# Altium schematic sheet UI.SchDoc
size A3; SheetNumber: 1; SheetTotal: 6
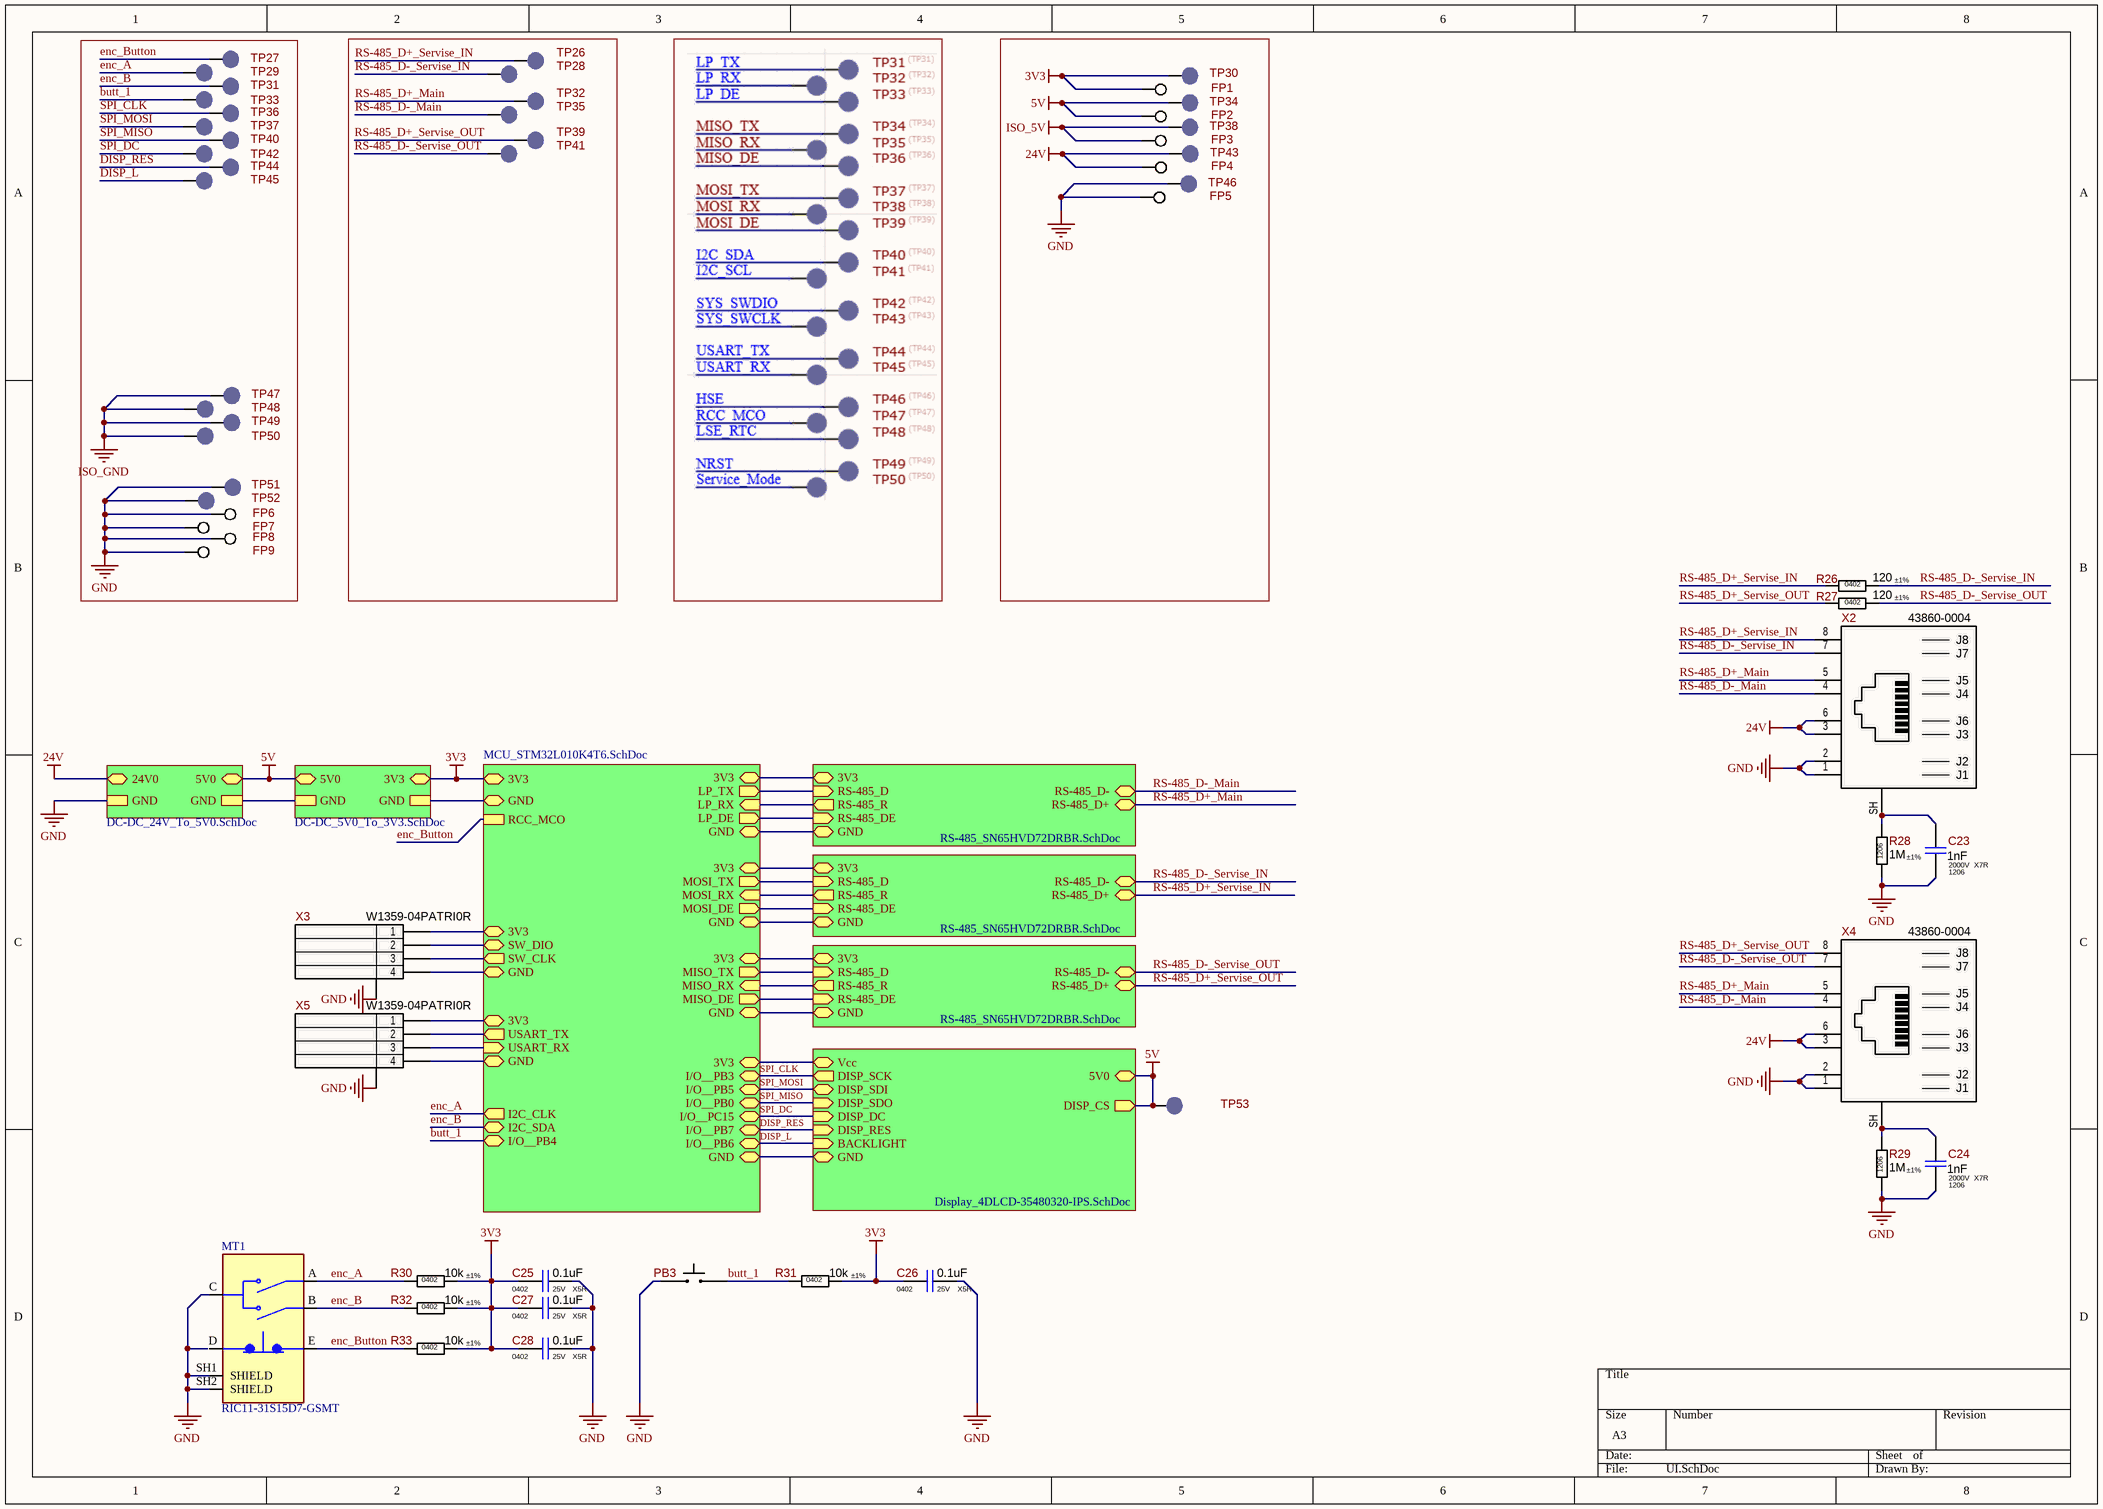
[diagram p0: UI.SchDoc]

## Parts
C23  Package: 1206  Voltage: 2000V  Dielectric Type: X7R  [CAP-1206(3216)X125T20]  (hidden comment: 1nF)
C24  Package: 1206  Voltage: 2000V  Dielectric Type: X7R  [CAP-1206(3216)X125T20]  (hidden comment: 1nF)
C25  Package: 0402  Voltage: 25V  Dielectric Type: X5R  [C_CERAMIC_0402_HI]  (hidden comment: 0.1uF)
C26  Package: 0402  Voltage: 25V  Dielectric Type: X5R  [C_CERAMIC_0402_HI]  (hidden comment: 0.1uF)
C27  Package: 0402  Voltage: 25V  Dielectric Type: X5R  [C_CERAMIC_0402_HI]  (hidden comment: 0.1uF)
C28  Package: 0402  Voltage: 25V  Dielectric Type: X5R  [C_CERAMIC_0402_HI]  (hidden comment: 0.1uF)
FP1  PAD-1.1mm  [PAD-1.1mm]  (value not drawn)  (no BOM)
FP2  PAD-1.1mm  [PAD-1.1mm]  (value not drawn)  (no BOM)
FP3  PAD-1.1mm  [PAD-1.1mm]  (value not drawn)  (no BOM)
FP4  PAD-1.1mm  [PAD-1.1mm]  (value not drawn)  (no BOM)
FP5  PAD-1.1mm  [PAD-1.1mm]  (value not drawn)  (no BOM)
FP6  PAD-1.1mm  [PAD-1.1mm]  (value not drawn)  (no BOM)
FP7  PAD-1.1mm  [PAD-1.1mm]  (value not drawn)  (no BOM)
FP8  PAD-1.1mm  [PAD-1.1mm]  (value not drawn)  (no BOM)
FP9  PAD-1.1mm  [PAD-1.1mm]  (value not drawn)  (no BOM)
MT1  RIC11-31S15D7-GSMT  [XDCR_RIC11-31S15D7-GSMT]
PB3  DS1042-24-2017VBR16005  [DS1042-24-2017VB]  (value not drawn)
R26  Tolerance: ±1%  Package: 0402  [R_ANY_CHIP_0402_HI]  (hidden comment: 120)
R27  Tolerance: ±1%  Package: 0402  [R_ANY_CHIP_0402_HI]  (hidden comment: 120)
R28  Tolerance: ±1%  Package: 1206  [CHV1206-Series]  (hidden comment: 1M)
R29  Tolerance: ±1%  Package: 1206  [CHV1206-Series]  (hidden comment: 1M)
R30  Tolerance: ±1%  Package: 0402  [R_ANY_CHIP_0402_MED]  (hidden comment: 10k)
R31  Tolerance: ±1%  Package: 0402  [R_ANY_CHIP_0402_MED]  (hidden comment: 10k)
R32  Tolerance: ±1%  Package: 0402  [R_ANY_CHIP_0402_MED]  (hidden comment: 10k)
R33  Tolerance: ±1%  Package: 0402  [R_ANY_CHIP_0402_MED]  (hidden comment: 10k)
TP26  LED_LINK  [TP_SMD_2mm]  (value not drawn)  (no BOM)
TP27  LED_LINK  [TP_SMD_2mm]  (value not drawn)  (no BOM)
TP28  LED_LINK  [TP_SMD_2mm]  (value not drawn)  (no BOM)
TP29  LED_LINK  [TP_SMD_2mm]  (value not drawn)  (no BOM)
TP30  LED_LINK  [TP_SMD_2mm]  (value not drawn)  (no BOM)
TP31  LED_LINK  [TP_SMD_2mm]  (value not drawn)  (no BOM)
TP32  LED_LINK  [TP_SMD_2mm]  (value not drawn)  (no BOM)
TP33  LED_LINK  [TP_SMD_2mm]  (value not drawn)  (no BOM)
TP34  LED_LINK  [TP_SMD_2mm]  (value not drawn)  (no BOM)
TP35  LED_LINK  [TP_SMD_2mm]  (value not drawn)  (no BOM)
TP36  LED_LINK  [TP_SMD_2mm]  (value not drawn)  (no BOM)
TP37  LED_LINK  [TP_SMD_2mm]  (value not drawn)  (no BOM)
TP38  LED_LINK  [TP_SMD_2mm]  (value not drawn)  (no BOM)
TP39  LED_LINK  [TP_SMD_2mm]  (value not drawn)  (no BOM)
TP40  LED_LINK  [TP_SMD_2mm]  (value not drawn)  (no BOM)
TP41  LED_LINK  [TP_SMD_2mm]  (value not drawn)  (no BOM)
TP42  LED_LINK  [TP_SMD_2mm]  (value not drawn)  (no BOM)
TP43  LED_LINK  [TP_SMD_2mm]  (value not drawn)  (no BOM)
TP44  LED_LINK  [TP_SMD_2mm]  (value not drawn)  (no BOM)
TP45  LED_LINK  [TP_SMD_2mm]  (value not drawn)  (no BOM)
TP46  LED_LINK  [TP_SMD_2mm]  (value not drawn)  (no BOM)
TP47  LED_LINK  [TP_SMD_2mm]  (value not drawn)  (no BOM)
TP48  LED_LINK  [TP_SMD_2mm]  (value not drawn)  (no BOM)
TP49  LED_LINK  [TP_SMD_2mm]  (value not drawn)  (no BOM)
TP50  LED_LINK  [TP_SMD_2mm]  (value not drawn)  (no BOM)
TP51  LED_LINK  [TP_SMD_2mm]  (value not drawn)  (no BOM)
TP52  LED_LINK  [TP_SMD_2mm]  (value not drawn)  (no BOM)
TP53  LED_LINK  [TP_SMD_2mm]  (value not drawn)  (no BOM)
X2  43860-0004  [43860-0004]
X3  W1359-04PATRI0R  [W1359-04PATXI0R_DBG]
X4  43860-0004  [43860-0004]
X5  W1359-04PATRI0R  [W1359-04PATXI0R_DBG]

## Sub-sheets
LDO_3V3 = DC-DC_5V0_To_3V3.SchDoc: 3V3 (bidir), 5V0 (bidir), GND, GND
LDO_3V3 = DC-DC_24V_To_5V0.SchDoc: 5V0 (bidir), 24V0 (bidir), GND, GND
MCU = MCU_STM32L010K4T6.SchDoc: LP_TX (out), LP_RX (in), LP_DE (out), MISO_TX (out), MISO_RX (in), MISO_DE (out), MOSI_RX (in), MOSI_TX (out), MOSI_DE (out), I2C_SDA (bidir), I2C_CLK (out), SW_DIO (bidir), SW_CLK (out), USART_TX (out), USART_RX (in), RCC_MCO, I/O__PB0 (bidir), I/O__PB3 (bidir), I/O__PB4 (bidir), I/O__PB5 (bidir), I/O__PB6 (bidir), I/O__PB7 (bidir), I/O__PC15 (bidir), 3V3 (bidir), 3V3 (bidir), 3V3 (bidir), 3V3 (bidir), 3V3 (bidir), GND (bidir), GND (bidir), GND (bidir), GND (bidir), GND (bidir), GND (bidir), GND (bidir), 3V3 (bidir), 3V3 (bidir)
RS-485 = RS-485_SN65HVD72DRBR.SchDoc: 3V3 (bidir), RS-485_D+ (bidir), RS-485_D- (bidir), RS-485_R (out), RS-485_D (in), RS-485_DE (in), GND (bidir)
RS-485 = RS-485_SN65HVD72DRBR.SchDoc: 3V3 (bidir), RS-485_D+ (bidir), RS-485_D- (bidir), RS-485_R (out), RS-485_D (in), RS-485_DE (in), GND (bidir)
RS-485 = RS-485_SN65HVD72DRBR.SchDoc: 3V3 (bidir), RS-485_D+ (bidir), RS-485_D- (bidir), RS-485_R (out), RS-485_D (in), RS-485_DE (in), GND (bidir)
RS-486 = Display_4DLCD-35480320-IPS.SchDoc: Vcc (bidir), DISP_SDI (bidir), 5V0 (bidir), DISP_CS (out), DISP_DC (in), DISP_SDO (in), GND (bidir), DISP_SCK (out), DISP_RES (in), BACKLIGHT (in)

## Nets
3V3: C25.1 C26.1 C27.1 C28.1 FP1.1 R30.1 R31.1 R32.1 R33.1 TP30.1 ; sheet LDO_3V3/3V3, sheet MCU/3V3
5V: FP2.1 TP34.1 TP53.1 ; sheet LDO_3V3/5V0, sheet LDO_3V3/5V0, sheet RS-486/5V0, sheet RS-486/DISP_CS
24V: FP4.1 TP43.1 X2.3(TD3-) X2.6(CT) X4.3(TD3-) X4.6(CT) ; sheet LDO_3V3/24V0
GND: C23.2 C24.2 C25.2 C26.2 C27.2 C28.2 FP5.1 FP6.1 FP7.1 FP8.1 FP9.1 MT1.C MT1.SH1(SHIELD) MT1.SH2(SHIELD) PB3.1 R28.2 R29.2 TP46.1 TP51.1 TP52.1 X2.1(TD4-) X2.2(TD4+) X3.MP(MountPad) X4.1(TD4-) X4.2(TD4+) X5.MP(MountPad) ; sheet LDO_3V3/GND
ISO_5V: FP3.1 TP38.1
ISO_GND: TP47.1 TP48.1 TP49.1 TP50.1
butt_1: PB3.2 R31.2 TP33.1 ; sheet MCU/I/O__PB4
DISP_L: TP45.1 ; sheet MCU/I/O__PB6, sheet RS-486/BACKLIGHT
DISP_RES: TP44.1 ; sheet MCU/I/O__PB7, sheet RS-486/DISP_RES
enc_A: MT1.A R30.2 TP29.1 ; sheet MCU/I2C_CLK
enc_B: MT1.B R32.2 TP31.1 ; sheet MCU/I2C_SDA
enc_Button: MT1.E(S2) R33.2 TP27.1 ; sheet MCU/RCC_MCO
RS-485_D+_Main: TP32.1 X2.5(CT) X4.5(CT) ; sheet RS-485/RS-485_D+
RS-485_D+_Servise_IN: R26.1 TP26.1 X2.8(TD2+) ; sheet RS-485/RS-485_D+
RS-485_D+_Servise_OUT: R27.1 TP39.1 X4.8(TD2+) ; sheet RS-485/RS-485_D+
RS-485_D-_Main: TP35.1 X2.4(TD3+) X4.4(TD3+) ; sheet RS-485/RS-485_D-
RS-485_D-_Servise_IN: R26.2 TP28.1 X2.7(TD2-) ; sheet RS-485/RS-485_D-
RS-485_D-_Servise_OUT: R27.2 TP41.1 X4.7(TD2-) ; sheet RS-485/RS-485_D-
SPI_CLK: TP36.1 ; sheet MCU/I/O__PB3, sheet RS-486/DISP_SCK
SPI_DC: TP42.1 ; sheet MCU/I/O__PC15, sheet RS-486/DISP_DC
SPI_MISO: TP40.1 ; sheet MCU/I/O__PB0, sheet RS-486/DISP_SDO
SPI_MOSI: TP37.1 ; sheet MCU/I/O__PB5, sheet RS-486/DISP_SDI
NetC23_1: C23.1 R28.1 X2.SH(Shield)
NetC24_1: C24.1 R29.1 X4.SH(Shield)
NetX3_1: X3.1 ; sheet MCU/3V3
NetX3_2: X3.2 ; sheet MCU/SW_DIO
NetX3_3: X3.3 ; sheet MCU/SW_CLK
NetX3_4: X3.4 ; sheet MCU/GND
NetX5_1: X5.1 ; sheet MCU/3V3
NetX5_2: X5.2 ; sheet MCU/USART_TX
NetX5_3: X5.3 ; sheet MCU/USART_RX
NetX5_4: X5.4 ; sheet MCU/GND
(unnamed): sheet LDO_3V3/GND, sheet MCU/GND
(unnamed): sheet LDO_3V3/GND, sheet LDO_3V3/GND
(unnamed): sheet MCU/LP_TX, sheet RS-485/RS-485_D
(unnamed): sheet MCU/LP_RX, sheet RS-485/RS-485_R
(unnamed): sheet MCU/LP_DE, sheet RS-485/RS-485_DE
(unnamed): sheet MCU/MISO_TX, sheet RS-485/RS-485_D
(unnamed): sheet MCU/MISO_RX, sheet RS-485/RS-485_R
(unnamed): sheet MCU/MISO_DE, sheet RS-485/RS-485_DE
(unnamed): sheet MCU/MOSI_RX, sheet RS-485/RS-485_R
(unnamed): sheet MCU/MOSI_TX, sheet RS-485/RS-485_D
(unnamed): sheet MCU/MOSI_DE, sheet RS-485/RS-485_DE
(unnamed): sheet MCU/3V3, sheet RS-485/3V3
(unnamed): sheet MCU/3V3, sheet RS-485/3V3
(unnamed): sheet MCU/GND, sheet RS-485/GND
(unnamed): sheet MCU/GND, sheet RS-485/GND
(unnamed): sheet MCU/GND, sheet RS-486/GND
(unnamed): sheet MCU/GND, sheet RS-485/GND
(unnamed): sheet MCU/3V3, sheet RS-485/3V3
(unnamed): sheet MCU/3V3, sheet RS-486/Vcc

Not connected (* = marked no-connect by the designer): MT1 D(S1)

## Notes on the sheet
- (in symbol 43860-0004) J8; J7; J5; J4; J6; J3; J2; J1

## Library data of the parts
C23 C24 = Capacitor-NonPolar: 1nF 2000V X7R ±10% 1206 Ceramic Capacitor RoHS; Part Number: CC1206KKX7RDBB102; Manufacturer: Yageo; Replacement: NONE; Value: 1nF; Part Type: Ceramic / X7R / 1206; Component Type: SMD; Temperature Range: -55°C ~ 125°C; Tolerance: ±10%; ComponentLink1URL: https://www.yageo.com/upload/media/product/products/datasheet/mlcc/UPY-NP0X7R_HV_1KV-to-3KV_11.pdf; Supplier 1: Digi-Key; Supplier Part Number 1: 311-1487-2-ND; ComponentLink1Description: Datasheet
C25-C28 = CL05A104KA5NNNC: 100nF 25V X5R ±10% 0402 Ceramic Capacitor RoHS; Manufacturer: Samsung Electro-Mechanics; Standard Lead Time: 38 Weeks; Replacement: NONE; Component Status: Released; Value: 0.1uF; Part Number: CL05A104KA5NNNC; Part Type: Ceramic / X5R / 0402; Component Type: SMD; Temperature Range: -55°C ~ 85°C; Tolerance: ±10%; ComponentLink1URL: https://eu.mouser.com/datasheet/2/585/MLCC-1837944.pdf; Supplier 1: Mouser; Supplier Part Number 1: 187-CL05A104KA5NNNC; ComponentLink1Description: Datasheet; Price: 0.0013
FP1-FP9 = Pad: 1.1mm Pad for Plug-In or Receptacle; Manufacturer: NONE; Component Status: Released; Part Number: PAD-1.1mm; Component Type: PTH; Part Type: Pad; Temperature Range: NONE; ComponentLink1URL: NONE; Replacement: NONE; ComponentLink1Description: Datasheet; Price: NONE
MT1 = RIC11-31S15D7-GSMT: Encoders MECH, 15 PPR 30 DET, 5 Vdc, SW, 7 mm smth bush, D shaft, horizontal, GSMT; Resolution: 15 PPR; Number of Detents: 30 Detent; Number of Channels: 1 Channel; Output Type: Quadrature; Shaft Diameter: 6 mm; With Switch: Push; Operating Supply Voltage: 5 V; Life: 100000 Cycle; Brand: Same Sky; Package: None; Price: None; Value: *; MP: RIC11-31S15D7-GSMT; Availability: Unavailable; Part Number: RIC11-31S15D7-GSMT; Supplier 1: Mouser; Supplier Part Number 1: 179-RIC1131S15D7GSMT; Mounting Style: SMD/SMT; Product: Mechanical Panel Mount Encoders; Type: Incremental; Technology: Mechanical; Orientation: Vertical
PB3 = DS1042-24-2017VBR16005: Tactile Switch 2.5x3mm, SMD, 160gf, Height 1.7mm, 50mA 12VDC; Manufacturer: Connfly; Replacement: NONE; Part Number: DS1042-24-2017VBR16005; Part Type: Switch / Tactile; Component Type: SMD; Temperature Range: -20°C ~ 70°C
R26 R27 = Resistor: 120 Ohms ±1% 1/16W 0402 Thick Film Resistor; Part Number: RC0402FR-07120RL; Manufacturer: Yageo; Power Rating: 0.062W; Voltage: 50V; Component Status: Released; Temperature Stability: ±100ppm/°C; Replacement: NONE; Value: 120; Component Type: SMD; Part Type: Thick Film; Temperature Range: -55°C ~ 155°C; ComponentLink1URL: https://eu.mouser.com/datasheet/2/447/PYu_RC_Group_51_RoHS_L_10-1664068.pdf; Price: 0.00065; ComponentLink1Description: Datasheet
R28 R29 = Resistor: 1 MOhms ±1%, 1/4W 1206 Thick Film Resistor; Part Number: CHV1206-FX-1004ELF; Manufacturer: Bourns; Power Rating: 0.25W; Voltage: 800V; Component Status: Released; Temperature Stability: ±100ppm/°C; Replacement: NONE; Value: 1M; Component Type: SMD; Part Type: Thick Film; Temperature Range: -55°C ~ 155°C; ComponentLink1URL: https://eu.mouser.com/datasheet/2/54/CHV-777595.pdf; Supplier 1: Mouser; Supplier Part Number 1: 652-CHV1206FX1004ELF; Price: 0.0173216; ComponentLink1Description: Datasheet
R30-R33 = RC0402FR-0710KL: 10 kOhms ±1% 1/16W 0402 Thick Film Resistor; Manufacturer: Yageo; Power Rating: 0.062W; Voltage: 50V; Temperature Stability: ±100ppm/°C; Replacement: NONE; Component Status: Released; Value: 10k; Part Number: RC0402FR-0710KL; Component Type: SMD; Temperature Range: -55°C ~ 155°C; ComponentLink1URL: https://eu.mouser.com/datasheet/2/447/PYu_RC_Group_51_RoHS_L_10-1664068.pdf; Supplier 1: Digi-Key; Supplier Part Number 1: 311-10.0KLRTR-ND; ComponentLink1Description: Datasheet; Part Type: Thick Film; Price: 0,00065
TP26-TP53 = Test-Point-SMD-1: Test Point SMD Pad 1.0mm/1.5mm/2mm; Part Number: TP-PAD-SMD; Replacement: NONE; Part Type: Test Point; Component Type: SMD; Temperature Range: NONE; ComponentLink1URL: NONE; ComponentLink1Description: Datasheet
X2 X4 = 43860-0004: RJ45 8P8C Shielded Cat 3 10 Base-T Connector; Manufacturer: Molex; Component Status: Released; Replacement: NONE; Part Number: 43860-0004; Part Type: RJ-45; Component Type: PTH; Temperature Range: -40°C ~ 85°C; ComponentLink1URL: https://www.molex.com/pdm_docs/sd/438600004_sd.pdf; Supplier 1: Mouser; Supplier Part Number 1: 538-43860-0004; Price: 2.1435; ComponentLink1Description: Datasheet
X3 X5 = General-4-Pin-MP: 1.25mm Wire-to-Board Header, Vertical, SMT, 4 pin; Manufacturer: Hsuan Mao Technology; Component Status: Released; Replacement: 53398-0471; Part Number: W1359-04PATRI0R; Part Type: Wire-to-Board / 1.25mm; Component Type: SMD; Temperature Range: -40°C ~ 85°C; Price: 0.06